# Altium project UTHP Truck Cape.PrjPcb (part 1 of 2)
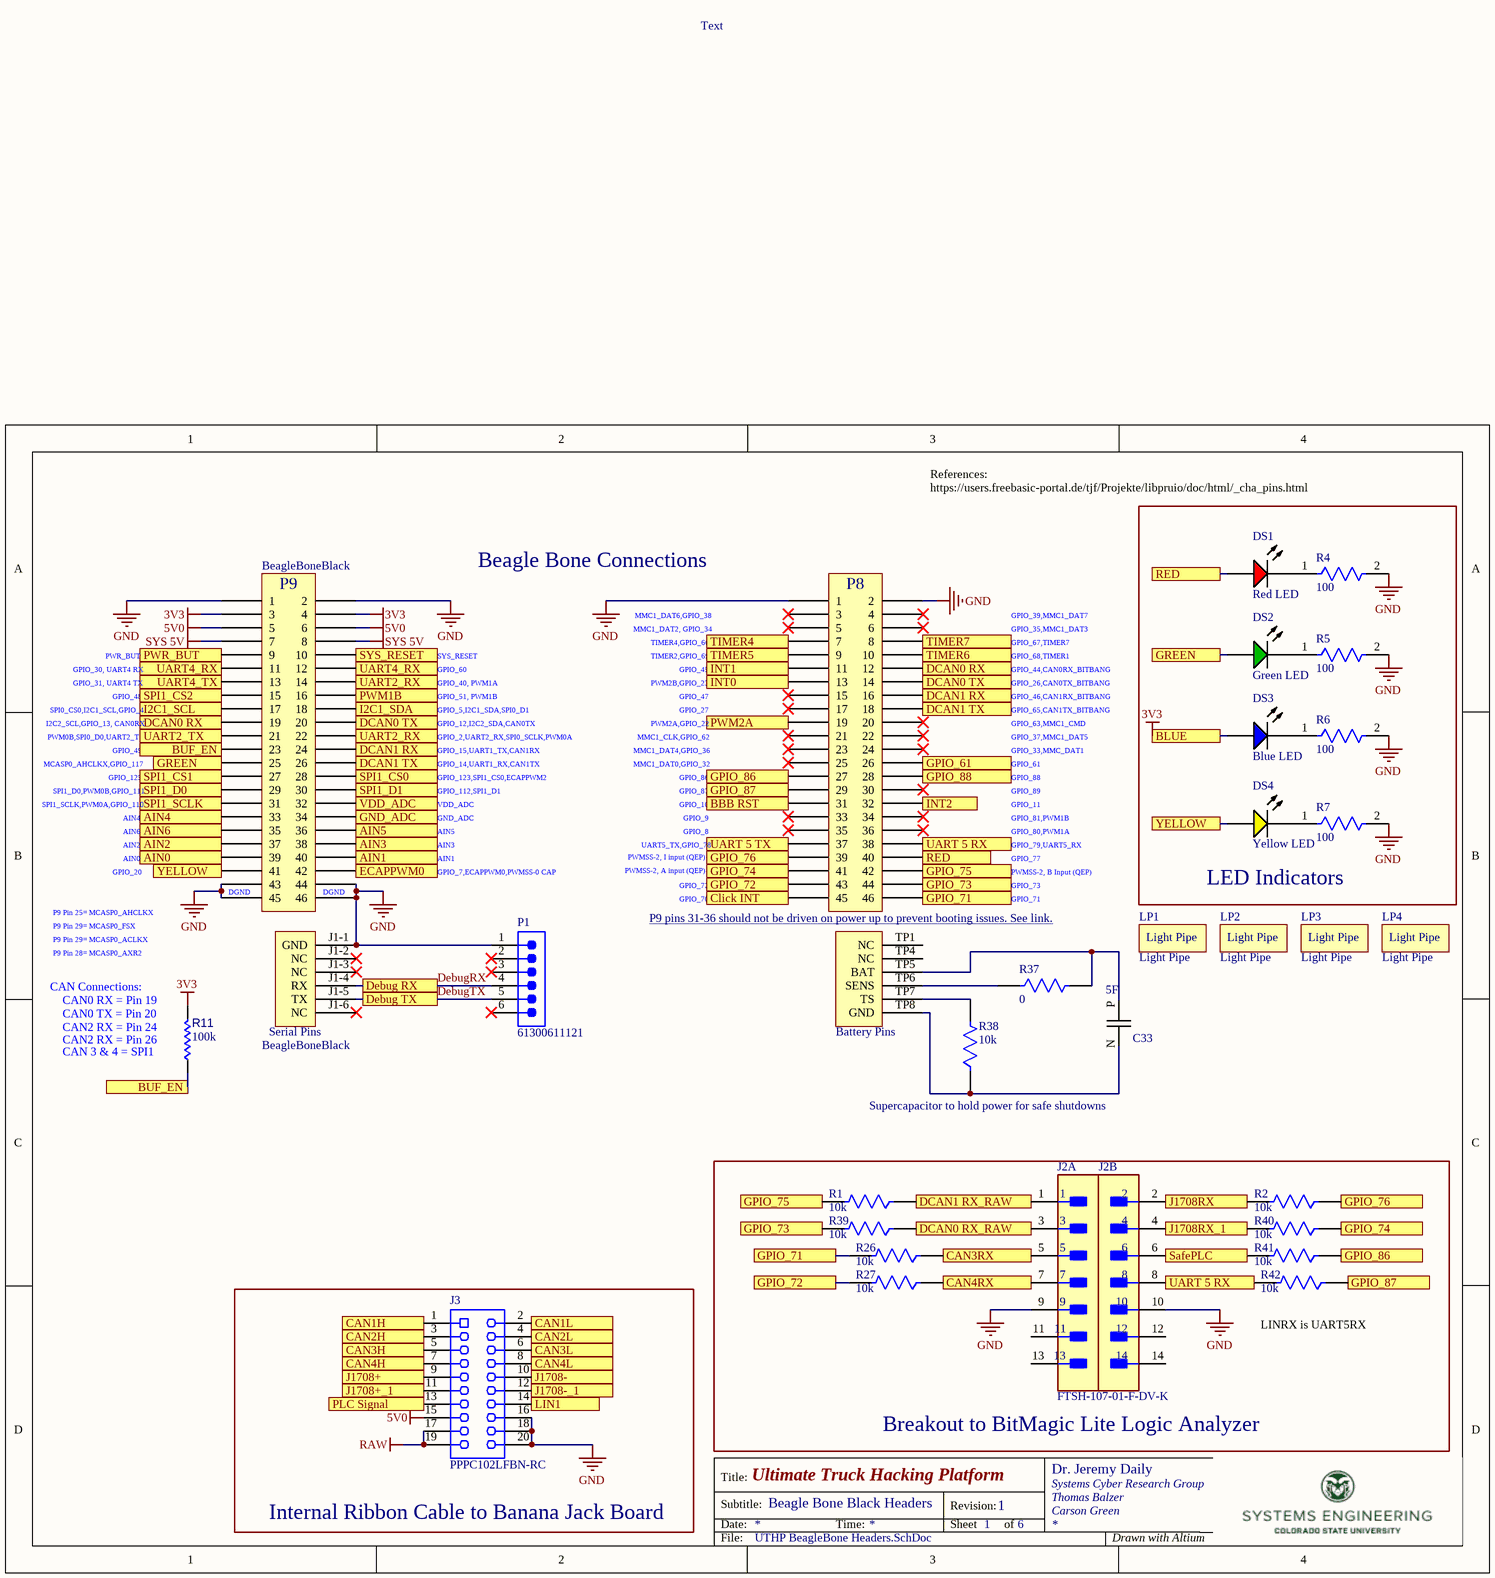
[diagram p0: UTHP BeagleBone Headers.SchDoc]
Sheet1Name: UTHP BeagleBone Headers; Sheet2Name: UTHP CAN Connections; SheetName3: UTHP Buffer Circuits; SheetSubtitle: BeagleBone Headers
6 sheets, 134 parts. Net scope: flat (ports and power ports of the same name join across sheets).
Board file: UTHP_PCB1.PcbDoc
Sheets:
  UTHP BeagleBone Headers.SchDoc
  UTHP CAN Connections.SchDoc
  UTHP Edge Connectors.SchDoc
  UTHP Power Supply and PLC.SchDoc
  UTHP Buffer Circuits.SchDoc
  UTHP J1708 LIN RTC.SchDoc

## Sheet UTHP BeagleBone Headers.SchDoc: Ultimate Truck Hacking Platform
size Letter; Author: Dr. Jeremy Daily; Organization: Systems Cyber Research Group; Address2: Thomas Balzer; Address3: Carson Green; DocumentNumber: Beagle Bone Black Headers; Revision: 1; SheetNumber: 1; SheetTotal: 6; ENG_APP_DATE: --/--/--; DSN_APP_DATE: --/--/--; CHK_APP_DATE: --/--/--

### Parts
BeagleBoneBlack  BeagleBoneBlack  [Beagleboneblack]
C33  5F  [New footprint 1]
DS1  Red LED  [LTST-C191KRKT_V]
DS2  Green LED  [LTST-C190GKT_V]
DS3  Blue LED  [LTST-C190TBKT-2_V]
DS4  Yellow LED  [LTST-C190KSKT_V]
J2  FTSH-107-01-F-DV-K  [FP-FTSH-107-01-F-DV-K-MFG]  (parts A,B of 2)
J3  PPPC102LFBN-RC  [SLIN-PPPC102LFBN-RC_V]
LP1  Light Pipe  [Lightpipe - SLP3]
LP2  Light Pipe  [Lightpipe - SLP3]
LP3  Light Pipe  [Lightpipe - SLP3]
LP4  Light Pipe  [Lightpipe - SLP3]
P1  61300611121  [61300611121]
R1  10k  [FP-KTR03-IPC_B]
R2  10k  [FP-KTR03-IPC_B]
R4  100  [FP-CRGCQ0603-IPC_C]
R5  100  [FP-CRGCQ0603-IPC_C]
R6  100  [FP-CRGCQ0603-IPC_C]
R7  100  [FP-CRGCQ0603-IPC_C]
R11  value 100k  [RESC1608X55X25ML10T15]  (hidden comment: Resistor 100k +/-1% 0603 100 mW)
R26  10k  [FP-KTR03-IPC_B]
R27  10k  [FP-KTR03-IPC_B]
R37  0  [FP-RMCF0805-MFG]
R38  10k  [FP-KTR03-IPC_B]
R39  10k  [FP-KTR03-IPC_B]
R40  10k  [FP-KTR03-IPC_B]
R41  10k  [FP-KTR03-IPC_B]
R42  10k  [FP-KTR03-IPC_B]

### Blocks framed on the sheet
LED Indicators: DS1-DS4 R4-R7
Breakout to BitMagic Lite Logic Analyzer: J2 R1 R2 R26 R27 R39-R42
Internal Ribbon Cable to Banana Jack Board: J3

### Ports
AIN0, AIN1, AIN2, AIN3, AIN4, AIN5, AIN6, BBB RST, BLUE, BUF_EN, CAN1H, CAN1L, CAN2H, CAN2L, CAN3H, CAN3L, CAN3RX, CAN4H, CAN4L, CAN4RX, Click INT, DCAN0 RX, DCAN0 RX_RAW, DCAN0 TX, DCAN1 RX, DCAN1 RX_RAW, DCAN1 TX, Debug RX, Debug TX, ECAPPWM0, GND_ADC, GPIO_61, GPIO_71, GPIO_72, GPIO_73, GPIO_74, GPIO_75, GPIO_76, GPIO_86, GPIO_87, GPIO_88, GREEN, I2C1_SCL, I2C1_SDA, INT0, INT1, INT2, J1708+, J1708+_1, J1708-, J1708-_1, J1708RX, J1708RX_1, LIN1, PLC Signal, PWM1B, PWM2A, PWR_BUT, RED, SafePLC, SPI1_CS0, SPI1_CS1, SPI1_CS2, SPI1_D0, SPI1_D1, SPI1_SCLK, SYS_RESET, TIMER4, TIMER5, TIMER6, TIMER7, UART2_RX, UART2_TX, UART4_RX, UART4_TX, UART 5 RX, UART 5 TX, VDD_ADC, YELLOW

### Nets
3V3: BeagleBoneBlack.3 BeagleBoneBlack.4 DS3.1(A) R11.2 ; port BLUE
5V0: BeagleBoneBlack.5 BeagleBoneBlack.6 J3.15
GND: BeagleBoneBlack.1 BeagleBoneBlack.2 BeagleBoneBlack.43 BeagleBoneBlack.44 BeagleBoneBlack.45 BeagleBoneBlack.46 BeagleBoneBlack.J1-1(GND) BeagleBoneBlack.P1(1) BeagleBoneBlack.P2(2) J2.9 J2.10 J3.16 J3.18 J3.20 P1.1 R4.2 R5.2 R6.2 R7.2
RAW: J3.17 J3.19
SYS 5V: BeagleBoneBlack.7 BeagleBoneBlack.8
AIN0: BeagleBoneBlack.39 ; port AIN0
AIN1: BeagleBoneBlack.40 ; port AIN1
AIN2: BeagleBoneBlack.37 ; port AIN2
AIN3: BeagleBoneBlack.38 ; port AIN3
AIN4: BeagleBoneBlack.33 ; port AIN4
AIN5: BeagleBoneBlack.36 ; port AIN5
AIN6: BeagleBoneBlack.35 ; port AIN6
BBB RST: BeagleBoneBlack.P31(31) ; port BBB RST
BUF_EN: BeagleBoneBlack.23 R11.1 ; port BUF_EN
CAN1H: J3.1 ; port CAN1H
CAN1L: J3.2 ; port CAN1L
CAN2H: J3.3 ; port CAN2H
CAN2L: J3.4 ; port CAN2L
CAN3H: J3.5 ; port CAN3H
CAN3L: J3.6 ; port CAN3L
CAN3RX: J2.5 R26.1 ; port CAN3RX
CAN4H: J3.7 ; port CAN4H
CAN4L: J3.8 ; port CAN4L
CAN4RX: J2.7 R27.1 ; port CAN4RX
Click INT: BeagleBoneBlack.P45(45) ; port Click INT
DCAN0 RX: BeagleBoneBlack.19 BeagleBoneBlack.P12(12) ; port DCAN0 RX
DCAN0 RX_RAW: J2.3 R39.1 ; port DCAN0 RX_RAW
DCAN0 TX: BeagleBoneBlack.20 BeagleBoneBlack.P14(14) ; port DCAN0 TX
DCAN1 RX: BeagleBoneBlack.24 BeagleBoneBlack.P16(16) ; port DCAN1 RX
DCAN1 RX_RAW: J2.1 R1.1 ; port DCAN1 RX_RAW
DCAN1 TX: BeagleBoneBlack.26 BeagleBoneBlack.P18(18) ; port DCAN1 TX
DebugRX: BeagleBoneBlack.J1-4(RX) P1.4 ; port Debug RX
DebugTX: BeagleBoneBlack.J1-5(TX) P1.5 ; port Debug TX
ECAPPWM0: BeagleBoneBlack.42 ; port ECAPPWM0
GND_ADC: BeagleBoneBlack.34 ; port GND_ADC
GPIO_61: BeagleBoneBlack.P26(26) ; port GPIO_61
GPIO_71: BeagleBoneBlack.P46(46) R26.2 ; port GPIO_71
GPIO_72: BeagleBoneBlack.P43(43) R27.2 ; port GPIO_72
GPIO_73: BeagleBoneBlack.P44(44) R39.2 ; port GPIO_73
GPIO_74: BeagleBoneBlack.P41(41) R40.1 ; port GPIO_74
GPIO_75: BeagleBoneBlack.P42(42) R1.2 ; port GPIO_75
GPIO_76: BeagleBoneBlack.P39(39) R2.1 ; port GPIO_76
GPIO_86: BeagleBoneBlack.P27(27) R41.1 ; port GPIO_86
GPIO_87: BeagleBoneBlack.P29(29) R42.1 ; port GPIO_87
GPIO_88: BeagleBoneBlack.P28(28) ; port GPIO_88
GREEN: BeagleBoneBlack.25 DS2.1(A) ; port GREEN
I2C1_SCL: BeagleBoneBlack.17 ; port I2C1_SCL
I2C1_SDA: BeagleBoneBlack.18 ; port I2C1_SDA
INT0: BeagleBoneBlack.P13(13) ; port INT0
INT1: BeagleBoneBlack.P11(11) ; port INT1
INT2: BeagleBoneBlack.P32(32) ; port INT2
J1708+: J3.9 ; port J1708+
J1708+_1: J3.11 ; port J1708+_1
J1708-: J3.10 ; port J1708-
J1708-_1: J3.12 ; port J1708-_1
J1708RX: J2.2 R2.2 ; port J1708RX
J1708RX_1: J2.4 R40.2 ; port J1708RX_1
LIN1: J3.14 ; port LIN1
PLC Signal: J3.13 ; port PLC Signal
PWM1B: BeagleBoneBlack.16 ; port PWM1B
PWM2A: BeagleBoneBlack.P19(19) ; port PWM2A
PWR_BUT: BeagleBoneBlack.9 ; port PWR_BUT
RED: BeagleBoneBlack.P40(40) DS1.1(A) ; port RED
SafePLC: J2.6 R41.2 ; port SafePLC
SPI1_CS0: BeagleBoneBlack.28 ; port SPI1_CS0
SPI1_CS1: BeagleBoneBlack.27 ; port SPI1_CS1
SPI1_CS2: BeagleBoneBlack.15 ; port SPI1_CS2
SPI1_D0: BeagleBoneBlack.29 ; port SPI1_D0
SPI1_D1: BeagleBoneBlack.30 ; port SPI1_D1
SPI1_SCLK: BeagleBoneBlack.31 ; port SPI1_SCLK
SYS_RESET: BeagleBoneBlack.10 ; port SYS_RESET
TIMER4: BeagleBoneBlack.P7(7) ; port TIMER4
TIMER5: BeagleBoneBlack.P9(9) ; port TIMER5
TIMER6: BeagleBoneBlack.P10(10) ; port TIMER6
TIMER7: BeagleBoneBlack.P8(8) ; port TIMER7
UART2_RX: BeagleBoneBlack.14 BeagleBoneBlack.22 ; port UART2_RX
UART2_TX: BeagleBoneBlack.21 ; port UART2_TX
UART4_RX: BeagleBoneBlack.11 BeagleBoneBlack.12 ; port UART4_RX
UART4_TX: BeagleBoneBlack.13 ; port UART4_TX
UART 5 RX: BeagleBoneBlack.P38(38) J2.8 R42.2 ; port UART 5 RX
UART 5 TX: BeagleBoneBlack.P37(37) ; port UART 5 TX
VDD_ADC: BeagleBoneBlack.32 ; port VDD_ADC
YELLOW: BeagleBoneBlack.41 DS4.1(A) ; port YELLOW
NetBeagleBoneBlack_TP5: BeagleBoneBlack.TP5(BAT) C33.P R37.2
NetBeagleBoneBlack_TP6: BeagleBoneBlack.TP6(SENS) R37.1
NetBeagleBoneBlack_TP7: BeagleBoneBlack.TP7(TS) R38.2
NetBeagleBoneBlack_TP8: BeagleBoneBlack.TP8(GND) C33.N R38.1
NetDS1_2: DS1.2(K) R4.1
NetDS2_2: DS2.2(K) R5.1
NetDS3_2: DS3.2(K) R6.1
NetDS4_2: DS4.2(K) R7.1

Not connected (* = marked no-connect by the designer): BeagleBoneBlack J1-2(NC)* J1-3(NC)* J1-6(NC)* P3(3)* P4(4)* P5(5)* P6(6)* P15(15)* P17(17)* P20(20)* P21(21)* P22(22)* P23(23)* P24(24)* P25(25)* P30(30)* P33(33)* P34(34)* P35(35)* P36(36)* TP1(NC) TP4(NC); J2 11 12 13 14; P1 2* 3* 6*

### Notes on the sheet
- Text
- References:
  https://users.freebasic-portal.de/tjf/Projekte/libpruio/doc/html/_cha_pins.html
- (near BeagleBoneBlack) Beagle Bone Connections
- PWR_BUT
- (near BeagleBoneBlack) SYS_RESET
- (near BeagleBoneBlack) MMC1_DAT2, GPIO_34
- (near BeagleBoneBlack) MMC1_DAT6,GPIO_38
- (near BeagleBoneBlack) TIMER4,GPIO_66
- (near BeagleBoneBlack) TIMER2,GPIO_69
- GPIO_39,MMC1_DAT7
- GPIO_35,MMC1_DAT3
- GPIO_67,TIMER7
- GPIO_68,TIMER1
- SPI0_CS0,I2C1_SCL,GPIO_4
- GPIO_30, UART4 RX
- GPIO_31, UART4 TX
- GPIO_48
- (near BeagleBoneBlack) GPIO_60
- (near BeagleBoneBlack) GPIO_40, PWM1A
- (near BeagleBoneBlack) GPIO_51, PWM1B
- (near BeagleBoneBlack) GPIO_5,I2C1_SDA,SPI0_D1
- (near BeagleBoneBlack) PWM2B,GPIO_23
- (near BeagleBoneBlack) GPIO_45
- (near BeagleBoneBlack) GPIO_47
- (near BeagleBoneBlack) GPIO_27
- GPIO_44,CAN0RX_BITBANG
- GPIO_26,CAN0TX_BITBANG
- GPIO_46,CAN1RX_BITBANG
- GPIO_65,CAN1TX_BITBANG
- MCASP0_AHCLKX,GPIO_117
- I2C2_SCL,GPIO_13, CAN0RX
- PWM0B,SPI0_D0,UART2_TX
- SPI1_D0,PWM0B,GPIO_111
- GPIO_125
- GPIO_49
- (near BeagleBoneBlack) GPIO_12,I2C2_SDA,CAN0TX
- (near BeagleBoneBlack) GPIO_2,UART2_RX,SPI0_SCLK,PWM0A
- (near BeagleBoneBlack) GPIO_15,UART1_TX,CAN1RX
- (near BeagleBoneBlack) GPIO_14,UART1_RX,CAN1TX
- (near BeagleBoneBlack) GPIO_123,SPI1_CS0,ECAPPWM2
- (near BeagleBoneBlack) GPIO_112,SPI1_D1
- (near BeagleBoneBlack) MMC1_DAT4,GPIO_36
- (near BeagleBoneBlack) MMC1_DAT0,GPIO_32
- (near BeagleBoneBlack) MMC1_CLK,GPIO_62
- (near BeagleBoneBlack) PWM2A,GPIO_22
- (near BeagleBoneBlack) GPIO_86
- (near BeagleBoneBlack) GPIO_87
- GPIO_63,MMC1_CMD
- GPIO_37,MMC1_DAT5
- GPIO_33,MMC_DAT1
- GPIO_61
- GPIO_88
- GPIO_89
- SPI1_SCLK,PWM0A,GPIO_110
- AIN4
- AIN6
- AIN2
- (near BeagleBoneBlack) VDD_ADC
- (near BeagleBoneBlack) GND_ADC
- (near BeagleBoneBlack) AIN5
- (near BeagleBoneBlack) AIN3
- (near BeagleBoneBlack) UART5_TX,GPIO_78
- (near BeagleBoneBlack) GPIO_10
- (near BeagleBoneBlack) GPIO_9
- (near BeagleBoneBlack) GPIO_8
- (near BeagleBoneBlack) PWMSS-2, I input (QEP)
- GPIO_11
- GPIO_81,PWM1B
- GPIO_80,PWM1A
- GPIO_79,UART5_RX
- P9 Pin 25= MCASP0_AHCLKX
- P9 Pin 29= MCASP0_FSX
- GPIO_20
- AIN0
- (near BeagleBoneBlack) DGND
- (near BeagleBoneBlack) AIN1
- (near BeagleBoneBlack) GPIO_7,ECAPPWM0,PWMSS-0 CAP
- (near BeagleBoneBlack) P9 pins 31-36 should not be driven on power up to prevent booting issues. See link. <https://docs.beagleboard.org/latest/boards/beaglebone/black/ch08.html#boot-pin>
- (near BeagleBoneBlack) GPIO_72
- (near BeagleBoneBlack) GPIO_70
- (near BeagleBoneBlack) PWMSS-2, A input (QEP)
- GPIO_77
- PWMSS-2, B Input (QEP)
- GPIO_73
- GPIO_71
- (near R11) CAN Connections:
- P9 Pin 29= MCASP0_ACLKX
- P9 Pin 28= MCASP0_AXR2
- (near R11) CAN0 TX = Pin 20
- (near R11) CAN0 RX = Pin 19
- (near R11) CAN2 RX = Pin 24
- (near R11) CAN2 RX = Pin 26
- (near R11) CAN 3 & 4 = SPI1
- (near R38) Supercapacitor to hold power for safe shutdowns
- Type @ to refer to a designator or a net
- (near R42) LINRX is UART5RX
- Title:
- Subtitle:
- Date:
- Time:
- Revision:
- Sheet
- of
- File:
- Drawn with Altium
- (in symbol CMP-061-000000-1) Serial Pins; Battery Pins

### Library data of the parts
BeagleBoneBlack = CMP-061-000000-1: Revision C with all headers and test points; Manufacturer: BeagleBoard by Seeed Studio; Part Number: 102110420; Value: BeagleBone Black Revision C; Supplier 1: Digi-Key; Supplier Part Number 1: 2820-102110420-ND
C33 = CMP-001-00088-1: DSF505Q6R0JBG; Manufacturer: Panasonic Electronic Components; Part Number: ERJ-3EKF4701V; Value: 4.7k; Supplier 1: Digi-Key; Supplier Part Number 1: P4.70KHCT-ND
DS1 = CMP-007-00024-2: LED Uni-Color Red, 62.5 mW, 25 mA, -30 to 85 degC, 2-Pin SMD, RoHS, Tape and Reel; Manufacturer: Lite-On
DS2 = CMP-007-00022-2: LED Uni-Color Green, 100 mW, 30 mA, -55 to 85 degC, 2-Pin SMD, RoHS, Tape and Reel; Manufacturer: Lite-On
DS3 = CMP-007-00026-2: LED Uni-Color Blue, 76 mW, 20 mA, -20 to 80 degC, 2-Pin SMD, RoHS, Tape and Reel; Manufacturer: Lite-On
DS4 = CMP-007-00025-2: LED Uni-Color Yellow, 75 mW, 30 mA, -30 to 85 degC, 2-Pin SMD, RoHS, Tape and Reel; Manufacturer: Lite-On
J2 = CMP-02766-001448-1: CONN HEADER SMD 14POS 1.27MM; Gender: Male; Connector Type: Male Pin; Number of Contacts: 14; Row Spacing: 0.05inch; Min Operating Temperature: -55°C; Package Quantity: 1; Lead Free: Lead Free; RoHS Compliant: Yes; Contact Material: Bronze; Contact Plating: Gold; Number of Rows: 2; Housing Material: Polymer; Contact Type: Male Pin; Series: FTSH; Max Operating Temperature: 125°C; Orientation: Straight; Number of Positions: 14; Pitch: 1.27mm; Housing Color: Black; Color: Black; Radiation Hardening: No; Length: 8.89mm; Termination: Solder; Packaging: Rail/Tube; Depth: 5.84mm; Mount: Surface Mount; Contact Mating Length: 0.12inch
J3 = CMP-002-00029-2: Female Header, Pitch 2.54 mm, 2 x 10 Position, Height 8.75 mm, Tail Length 3.2 mm, -40 to 105 degC, RoHS, Bulk; Manufacturer: Sullins
LP1-LP4 = CMP-023-000058-1: Design Item ID: Light Pipe; Source: SSS Schematic Library.SchLib; Pin Count: 0; Component Type: Standard
  LP1: Parameter 1: *
P1 = CMP-1502-01070-2: Termination: Through Hole
R1 R2 R26 R27 R38-R42 = CMP-08839-030382-1: 10 kOhms ±1% 0.1W, 1/10W Chip Resistor 0603 (1608 Metric) Automotive AEC-Q200, High Voltage Thick Film; Manufacturer: Rohm Semiconductor; Part Number: KTR03EZPF1002; Supplier 1: Digi-Key; Supplier Part Number 1: RHM10.0KAYCT-ND; Value: 10k
R4-R7 = CMP-03211-002191-1: CRGCQ0603 100Ω 1% ±200ppm/°C 75V; Manufacturer Part Number: CRGCQ0603F100R; Manufacturer: TE Connectivity; Value: 100Ω
R11 = CMP-009-00023-7: Chip Resistor, 100 KOhm, +/- 1%, 0.1 W, -55 to 155 degC, 0603 (1608 Metric); Voltage Rating: 50V; Power: 100mW; Max Operating Temperature: 155°C; Pins: 2; Mounting Technology: SM; Min Operating Temperature: -55°C; Case/Package: 0603; Tolerance: 1%; RoHS Compliant: True
R37 = CMP-26527-000017-1: RES 0 OHM JUMPER 1/8W 0805; Manufacturer: Stackpole Electronics Inc; Part Number: RMCF0805ZT0R00; Supplier 1: Digi-Key; Supplier Part Number 1: RMCF0805ZT0R00CT-ND; Value: 0

## Sheet UTHP CAN Connections.SchDoc: Ultimate Truck Hacking Platform
size Letter; Author: Dr. Jeremy Daily; Organization: Systems Cyber Research Group; Address2: Thomas Balzer; Address3: Carson Green; DocumentNumber: Controller Area Networks; Revision: 1; SheetNumber: 2; SheetTotal: 6
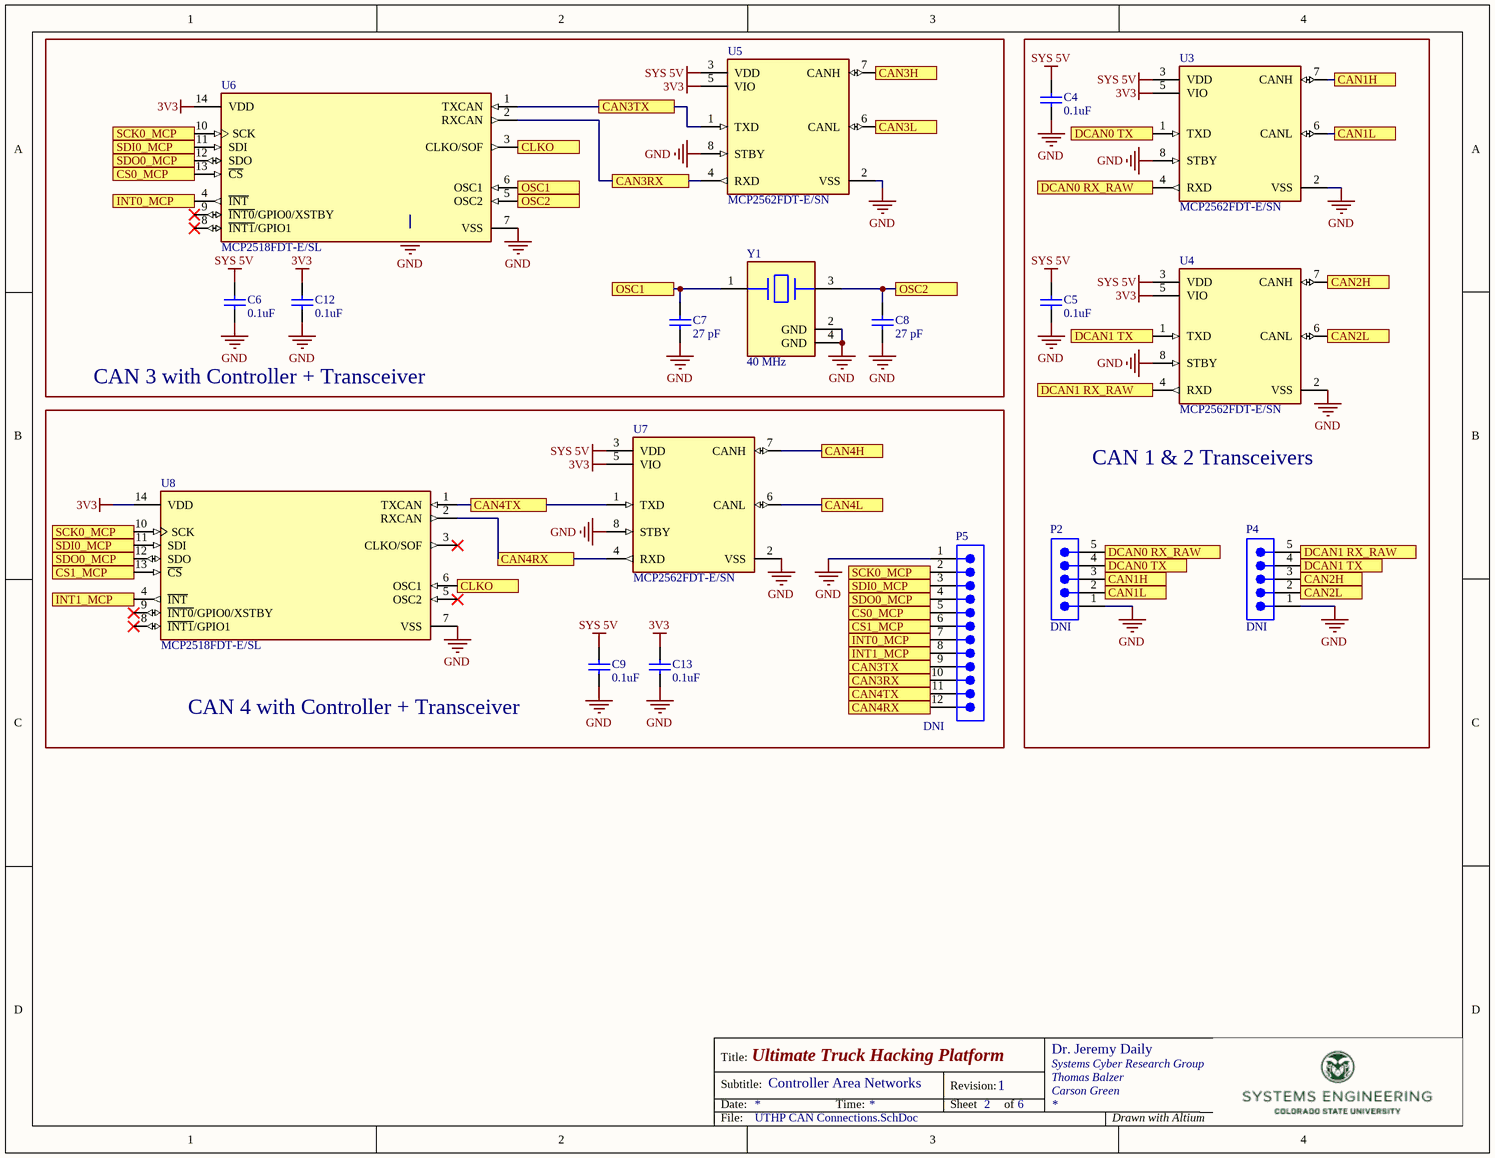
[diagram p1: UTHP CAN Connections.SchDoc]

### Parts
C4  0.1uF  [CAPC1608X90X35LL15T15]
C5  0.1uF  [CAPC1608X90X35LL15T15]
C6  0.1uF  [CAPC1608X90X35LL15T15]
C7  27 pF  [CAPC1005X55X25LL05T10]
C8  27 pF  [CAPC1005X55X25LL05T10]
C9  0.1uF  [CAPC1608X90X35LL15T15]
C12  0.1uF  [CAPC1608X90X35LL15T15]
C13  0.1uF  [CAPC1608X90X35LL15T15]
P2  DNI  [61300511121]
P4  DNI  [61300511121]
P5  DNI  [61301211121]
U3  MCP2562FDT-E/SN  [FP-C04-057-SN-MFG]
U4  MCP2562FDT-E/SN  [FP-C04-057-SN-MFG]
U5  MCP2562FDT-E/SN  [FP-C04-057-SN-MFG]
U6  MCP2518FDT-E/SL  [FP-C04-065-SL-IPC_C]
U7  MCP2562FDT-E/SN  [FP-C04-057-SN-MFG]
U8  MCP2518FDT-E/SL  [FP-C04-065-SL-IPC_C]
Y1  40 MHz  [FP-ABM8G-MFG]

### Blocks framed on the sheet
CAN 3 with Controller + Transceiver: C6-C8 C12 U5 U6 Y1
CAN 1 & 2 Transceivers: C4 C5 P2 P4 U3 U4
CAN 4 with Controller + Transceiver: C9 C13 P5 U7 U8

### Ports
CAN1H, CAN1L, CAN2H, CAN2L, CAN3H, CAN3L, CAN3RX, CAN3TX, CAN4H, CAN4L, CAN4RX, CAN4TX, CLKO, CS0_MCP, CS1_MCP, DCAN0 RX_RAW, DCAN0 TX, DCAN1 RX_RAW, DCAN1 TX, INT0_MCP, INT1_MCP, OSC1, OSC2, SCK0_MCP, SDI0_MCP, SDO0_MCP

### Nets
3V3: C12.1 C13.1 U3.5(VIO) U4.5(VIO) U5.5(VIO) U6.14(VDD) U7.5(VIO) U8.14(VDD)
GND: C4.2 C5.2 C6.2 C7.1 C8.1 C9.2 C12.2 C13.2 P2.1 P4.1 P5.1 U3.2(VSS) U3.8(STBY) U4.2(VSS) U4.8(STBY) U5.2(VSS) U5.8(STBY) U6.7(VSS) U7.2(VSS) U7.8(STBY) U8.7(VSS) Y1.2(GND) Y1.4(GND)
SYS 5V: C4.1 C5.1 C6.1 C9.1 U3.3(VDD) U4.3(VDD) U5.3(VDD) U7.3(VDD)
CAN1H: P2.3 U3.7(CANH) ; port CAN1H
CAN1L: P2.2 U3.6(CANL) ; port CAN1L
CAN2H: P4.3 U4.7(CANH) ; port CAN2H
CAN2L: P4.2 U4.6(CANL) ; port CAN2L
CAN3H: U5.7(CANH) ; port CAN3H
CAN3L: U5.6(CANL) ; port CAN3L
CAN3RX: P5.10 U5.4(RXD) U6.2(RXCAN) ; port CAN3RX
CAN3TX: P5.9 U5.1(TXD) U6.1(TXCAN) ; port CAN3TX
CAN4H: U7.7(CANH) ; port CAN4H
CAN4L: U7.6(CANL) ; port CAN4L
CAN4RX: P5.12 U7.4(RXD) U8.2(RXCAN) ; port CAN4RX
CAN4TX: P5.11 U7.1(TXD) U8.1(TXCAN) ; port CAN4TX
CLKO: U6.3(CLKO/SOF) U8.6(OSC1) ; port CLKO
CS0_MCP: P5.5 U6.13(~{CS}) ; port CS0_MCP
CS1_MCP: P5.6 U8.13(~{CS}) ; port CS1_MCP
DCAN0 RX_RAW: P2.5 U3.4(RXD) ; port DCAN0 RX_RAW
DCAN0 TX: P2.4 U3.1(TXD) ; port DCAN0 TX
DCAN1 RX_RAW: P4.5 U4.4(RXD) ; port DCAN1 RX_RAW
DCAN1 TX: P4.4 U4.1(TXD) ; port DCAN1 TX
INT0_MCP: P5.7 U6.4(~{INT}) ; port INT0_MCP
INT1_MCP: P5.8 U8.4(~{INT}) ; port INT1_MCP
OSC1: C7.2 U6.6(OSC1) Y1.1 ; port OSC1
OSC2: C8.2 U6.5(OSC2) Y1.3 ; port OSC2
SCK0_MCP: P5.2 U6.10(SCK) U8.10(SCK) ; port SCK0_MCP
SDI0_MCP: P5.3 U6.11(SDI) U8.11(SDI) ; port SDI0_MCP
SDO0_MCP: P5.4 U6.12(SDO) U8.12(SDO) ; port SDO0_MCP

Not connected (* = marked no-connect by the designer): U6 8(~{INT1}/GPIO1)* 9(~{INT0}/GPIO0/XSTBY)*; U8 3(CLKO/SOF)* 5(OSC2)* 8(~{INT1}/GPIO1)* 9(~{INT0}/GPIO0/XSTBY)*

### Notes on the sheet
- Title:
- Subtitle:
- Date:
- Time:
- Revision:
- Sheet
- of
- File:
- Drawn with Altium

### Library data of the parts
C4-C6 C9 C12 C13 = CMP-2006-04387-1: 0.1 µF ±10% 50V Ceramic Capacitor X7R 0603 (1608 Metric); Manufacturer: KYOCERA AVX; Part Number: KAM15AR71H104KM; Supplier 1: Digi-Key; Supplier Part Number 1: 478-KAM15AR71H104KMTR-ND; Value: 0.1uF
C7 C8 = CMP-2008-03917-1: 27 pF ±5% 50V Ceramic Capacitor C0G, NP0 0402 (1005 Metric); Part Number: GRM1555C1H270JA01D; Manufacturer: Murata; Value: 27pF; Supplier 1: Digi-Key; Supplier Part Number 1: 490-5869-1-ND
P2 P4 = CMP-1502-01068-2: NexarPartId: 32855526; Operating Supply Voltage: 250V; Number of Contacts: 5; Connector Type: Male Pin; Current Rating: 3A; Contact Resistance: 20mΩ; Pitch: 2.54mm; Gender: Male; Termination: Solder; RoHS: Compliant; Lead Pitch: 2.54mm; Contact Mating Length: 5.9944mm; Number of Positions: 5; Lead Free: Lead Free; Contact Plating: Gold; Number of Pins: 5; Min Operating Temperature: -40°C; Voltage Rating: 250V; Color: Black; Mount: Through Hole; REACH SVHC: Unknown; Packaging: Bulk; Height: 8.89mm; Number of Rows: 1; Orientation: Vertical; Contact Material: Copper; Max Operating Temperature: 105°C
P5 = CMP-1502-01086-2: NexarPartId: 32855538; Gender: Male; Pitch: 2.54mm; Contact Resistance: 20mΩ; Number of Positions: 12; Current Rating: 3A; Connector Type: Male Pin; Operating Supply Voltage: 250V; Contact Material: Copper; Contact Plating: Gold; Color: Black; REACH SVHC: Unknown; Termination: Solder; Number of Contacts: 12; RoHS: Compliant; Lead Pitch: 2.54mm; Orientation: Vertical; Contact Mating Length: 5.9944mm; Mount: Through Hole; Number of Pins: 12; Packaging: Bulk; Number of Rows: 1
U3-U5 U7 = CMP-06279-000005-1: 1/1 Transceiver CANbus 8-SOIC; Manufacturer: Microchip; Value: CAN Transceiver; Part Number: MCP2562FDT-E/SN; Supplier 1: Digi-Key; Supplier Part Number 1: MCP2562FDT-E/SNCT-ND
U6 U8 = CMP-06298-000019-1: IC CAN CONTROLLER SPI 14SOIC; RoHS Compliant: Yes
Y1 = CMP-27762-015223-1: 40 MHz ±20ppm Crystal 18pF 50 Ohms 4-SMD, No Lead; Manufacturer: Abracon LLC; Part Number: ABM8G-40.000MHZ-18-D2Y-T; Value: 40MHz; Supplier 1: Digi-Key; Supplier Part Number 1: 535-10281-1-ND

## Sheet UTHP Edge Connectors.SchDoc: Ultimate Truck Hacking Platform
size Letter; Author: Dr. Jeremy Daily; Organization: Systems Cyber Research Group; Address2: Thomas Balzer; Address3: Carson Green; DocumentNumber: Board Interfaces; Revision: 1; SheetNumber: 3; SheetTotal: 6
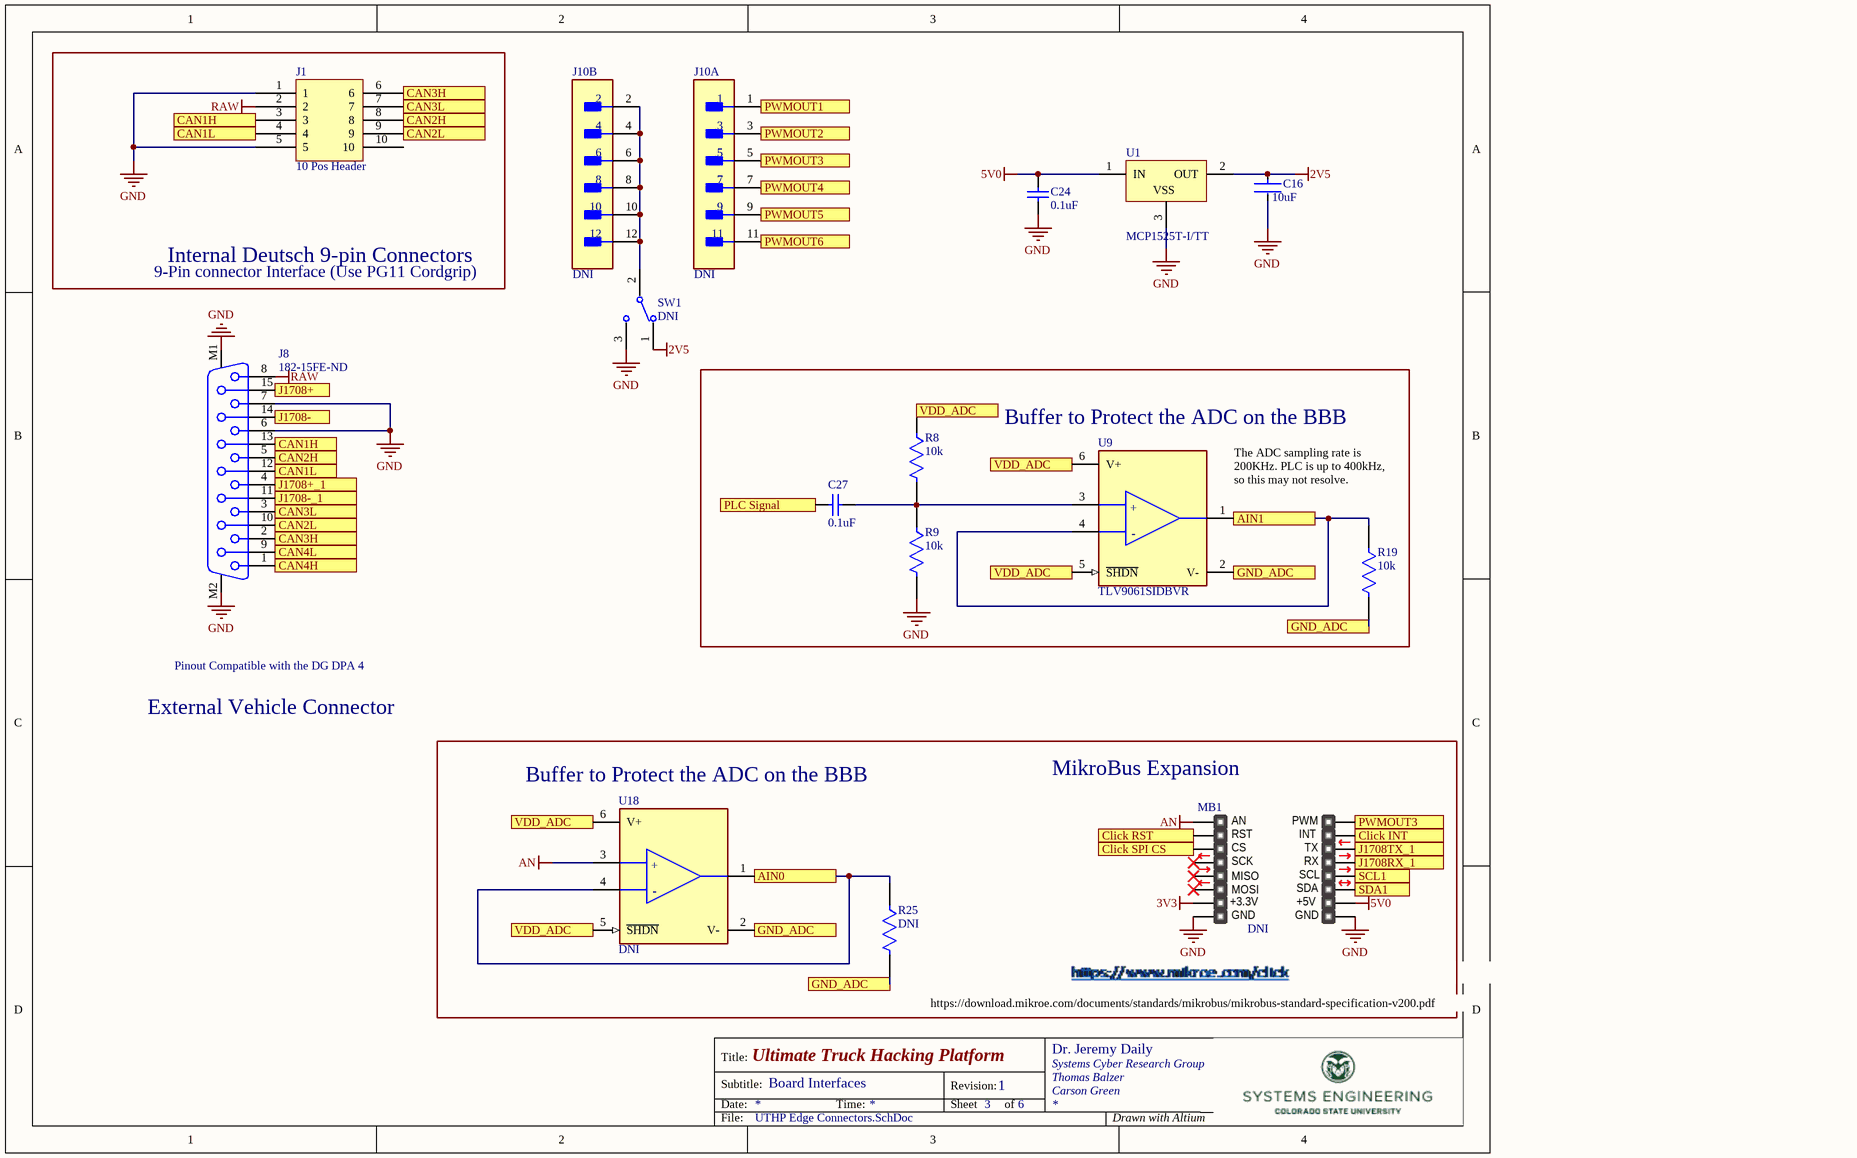
[diagram p2: UTHP Edge Connectors.SchDoc]

### Parts
C16  10uF  [FP-MK325A-MFG]
C24  0.1uF  [CAPC1608X90X35LL15T15]
C27  0.1uF  [CAPC1608X90X35LL15T15]
J1  10 Pos Header  [10 pos Mini-Fit Jr. R/A Header]
J8  182-15FE-ND  [618015231321]
J10  DNI  [FP-70246-1201-0]  (parts A,B of 2)
MB1  DNI  [mikroBUS - Large]  (no BOM)
R8  10k  [FP-KTR03-IPC_B]
R9  10k  [FP-KTR03-IPC_B]
R19  10k  [FP-KTR03-IPC_B]
R25  DNI  [FP-KTR03-IPC_B]
SW1  DNI  [FP-CS12ANW03-MFG]
U1  MCP1525T-I/TT  [SOT-23-TT3_M]
U9  TLV9061SIDBVR  [FP-DBV0006A-MFG]
U18  DNI  [FP-DBV0006A-MFG]

### Blocks framed on the sheet
Internal Deutsch 9-pin Connectors: J1
Buffer to Protect the ADC on the BBB: C27 R8 R9 R19 U9

### Ports
AIN0, AIN1, CAN1H, CAN1L, CAN2H, CAN2L, CAN3H, CAN3L, CAN4H, CAN4L, Click INT, Click RST, Click SPI CS, GND_ADC, J1708+, J1708+_1, J1708-, J1708-_1, J1708RX_1, J1708TX_1, PLC Signal, PWMOUT1, PWMOUT2, PWMOUT3, PWMOUT4, PWMOUT5, PWMOUT6, SCL1, SDA1, VDD_ADC

### Nets
2V5: C16.1 SW1.1 U1.2(OUT)
3V3: MB1.7(3.3V)
5V0: C24.1 MB1.10(5V) U1.1(IN)
AN: MB1.1(AN) U18.3(+IN)
GND: C16.2 C24.2 J1.1 J1.5 J8.6 J8.7 J8.M1 J8.M2 MB1.8(GND) MB1.9(GND) R9.2 SW1.3 U1.3(VSS)
RAW: J1.2 J8.8
AIN0: R25.1 U18.1(OUT) U18.4(-IN) ; port AIN0
AIN1: R19.1 U9.1(OUT) U9.4(-IN) ; port AIN1
CAN1H: J1.3 J8.13 ; port CAN1H
CAN1L: J1.4 J8.12 ; port CAN1L
CAN2H: J1.8 J8.5 ; port CAN2H
CAN2L: J1.9 J8.10 ; port CAN2L
CAN3H: J1.6 J8.2 ; port CAN3H
CAN3L: J1.7 J8.3 ; port CAN3L
CAN4H: J8.1 ; port CAN4H
CAN4L: J8.9 ; port CAN4L
Click INT: MB1.15(INT) ; port Click INT
Click RST: MB1.2(RST) ; port Click RST
Click SPI CS: MB1.3(CS) ; port Click SPI CS
GND_ADC: R19.2 R25.2 U9.2(V-) U18.2(V-) ; port GND_ADC
J1708+: J8.15 ; port J1708+
J1708+_1: J8.4 ; port J1708+_1
J1708-: J8.14 ; port J1708-
J1708-_1: J8.11 ; port J1708-_1
J1708RX_1: MB1.13(TX) ; port J1708RX_1
J1708TX_1: MB1.14(RX) ; port J1708TX_1
PLC Signal: C27.1 ; port PLC Signal
PWMOUT1: J10.1 ; port PWMOUT1
PWMOUT2: J10.3 ; port PWMOUT2
PWMOUT3: J10.5 MB1.16(PWM) ; port PWMOUT3
PWMOUT4: J10.7 ; port PWMOUT4
PWMOUT5: J10.9 ; port PWMOUT5
PWMOUT6: J10.11 ; port PWMOUT6
SCL1: MB1.12(SCL) ; port SCL1
SDA1: MB1.11(SDA) ; port SDA1
VDD_ADC: R8.1 U9.5(~{SHDN}) U9.6(V+) U18.5(~{SHDN}) U18.6(V+) ; port VDD_ADC
NetC27_2: C27.2 R8.2 R9.1 U9.3(+IN)
NetJ10_2: J10.2 J10.4 J10.6 J10.8 J10.10 J10.12 SW1.2(2(COM))

Not connected (* = marked no-connect by the designer): J1 10; MB1 4(SCK)* 5(MISO)* 6(MOSI)*

### Notes on the sheet
- 9-Pin connector Interface (Use PG11 Cordgrip)
- (near U9) The ADC sampling rate is 200KHz. PLC is up to 400kHz, so this may not resolve.
- Pinout Compatible with the DG DPA 4
- External Vehicle Connector
- (near MB1) MikroBus Expansion
- (near U18) Buffer to Protect the ADC on the BBB
- https://download.mikroe.com/documents/standards/mikrobus/mikrobus-standard-specification-v200.pdf
- Title:
- Subtitle:
- Date:
- Time:
- Revision:
- Sheet
- of
- File:
- Drawn with Altium
- (in symbol CMP-068-000000-1) +3.3V; +5V
- (in symbol CMP-04895-000376-1) +; -

### Library data of the parts
C16 = CMP-14477-002214-1: CAP CER 10UF 50V X7R 1210 UMK325AB7106KM-T; Manufacturer: Taiyo Yuden; Part Number: UMK325AB7106KM-T; Supplier 1: Digi-Key; Supplier Part Number 1: 587-3167-1-ND
C24 C27 = CMP-2006-04387-1: as C4 on sheet UTHP CAN Connections; Supplier 1: Digi-Key; Supplier Part Number 1: 478-KAM15AR71H104KMTR-ND; Value: 0.1uF
J1 = CMP-025-000000-1: Connector Header Through Hole, Right Angle 10 position 0.165" (4.20mm); Manufacturer: Molex; Value: Molex 10-pos; Part Number: 39-30-1100; Supplier 1: Digi-Key; Supplier Part Number 1: WM1355-ND
J8 = CMP-1502-00205-2: NorComp Inc. Part #: 182-015-213R531 / Digikey Part #: 182-15FE-ND / Link: https://www.digikey.com/en/products/detail/norcomp-inc/182-015-213R531/858357; NexarPartId: 22865747; Insulation Resistance: 5GΩ; Number of Contacts: 15; Pitch: 2.77mm; Current Rating: 3A; Contact Resistance: 30mΩ; Gender: Female; Operating Supply Voltage: 125V; Number of Rows: 2; Number of Pins: 15; Termination: SMD/SMT; Depth: 20.75mm; Orientation: Right Angle; Contact Plating: Gold; Width: 12.5mm; RoHS: Compliant; REACH SVHC: Unknown; Max Operating Temperature: 105°C; Housing Material: Steel; Min Operating Temperature: -55°C; Voltage Rating: 125V; Insulation Material: PBT; Mount: Through Hole; Length: 24.76mm
J10 = CMP-00257-00249961-1: 70246-1201 Conn Shrouded Header (4 Sides) HDR 12 POS 2.54mm Solder ST Top Entry Thru-Hole C-Grid® Tray; NexarPartId: 249961; Connector Type: Male Pin; Max Voltage Rating (DC): 250V; Gender: Male; Number of Contacts: 12; Current Rating: 2.5A; Glow Wire Compliant: Non-compliant; Max Operating Temperature: 120°C; ELV: Compliant; Contact Plating: Gold; Orientation: Vertical; Height: 9.47mm; Pitch: 2.54mm; Lead Free: Lead Free; Length: 22.86mm; Contact Mating Length: 6.096mm; Voltage Rating: 250V; RoHS: Compliant; REACH SVHC: No SVHC; Color: Black; Min Operating Temperature: -55°C; Termination: Solder; Housing Color: Black; Depth: 8.89mm; Flammability Rating: UL94 V-0; Number of Rows: 2; Row Spacing: 2.54mm; Housing Material: Polyester; Number of Positions: 12; Contact Material: Bronze, Gold, Nickel; Mount: Through Hole; Number of Circuits: 12
MB1 = CMP-068-000000-1: mikroBUS compatible add-on board
R8 R9 R19 = CMP-08839-030382-1: as R1 on sheet UTHP BeagleBone Headers; Supplier 1: Digi-Key; Supplier Part Number 1: RHM10.0KAYCT-ND; Value: 10k
R25 = CMP-08839-030382-1: 10 kOhms ±1% 0.1W, 1/10W Chip Resistor 0603 (1608 Metric) Automotive AEC-Q200, High Voltage Thick Film; Manufacturer: Rohm Semiconductor; Part Number: KTR03EZPF1002; Value: 10k; Supplier 1: Digi-Key; Supplier Part Number 1: RHM10.0KAYCT-ND
SW1 = CMP-31746-000002-1: SWITCH SLIDE SPDT 3A 125V; Max Voltage Rating (AC): 250V; Mechanical Life: 50000Cycles; Switch Travel: 2.2mm; Electrical Life: 20000Cycles; Actuator Length: 5.1mm; Illumination Type: Non-Illuminated; Contact Style: Non-Shorting; Actuator Type: Standard; Actuator Material: Nylon; Switch Function: On-On; Max Operating Temperature: 85°C; Series: CS; Contact Current Rating: 3A; Min Operating Temperature: -30°C; Current Rating: 3A; Mount: Through Hole; Depth: 7.5mm; RoHS Compliant: Yes; Throw Configuration: SPDT; Lead Free: Lead Free; Orientation: Vertical; Contact Plating: Silver; Reach SVHC Compliant: Yes; Termination: PC Pin; Max Current Rating: 3A; Packaging: Tray; Length: 14mm; Package Quantity: 1; Primary Type: SWITCH; Flammability Rating: UL94 V-0; Contact Material: Copper; Voltage Rating (AC): 125V
U1 = CMP-0131-00003-1: 2.5V Voltage Reference, 3-Pin SOT-23, Industrial Temperature, Tape and Reel; DatasheetVersion: revB, Feb-2005; Code_IPC: SOT23-3; PackageDescription: 3-Lead Plastic Small Outline Transistor (TT) [SOT-23]; PackageReference: SOT-23-TT3; PackageVersion: revBB, Aug-2009
U9 U18 = CMP-04895-000376-1: IC CMOS 1 CIRCUIT SOT23-6; RoHS Compliant: Yes

## Sheet UTHP Power Supply and PLC.SchDoc: Ultimate Truck Hacking Platform
size Letter; Author: Dr. Jeremy Daily; Organization: Systems Cyber Research Group; Address2: Thomas Balzer; Address3: Carson Green; DocumentNumber: Power, LIN, Logic Buffer; Revision: 1; SheetNumber: 4; SheetTotal: 6
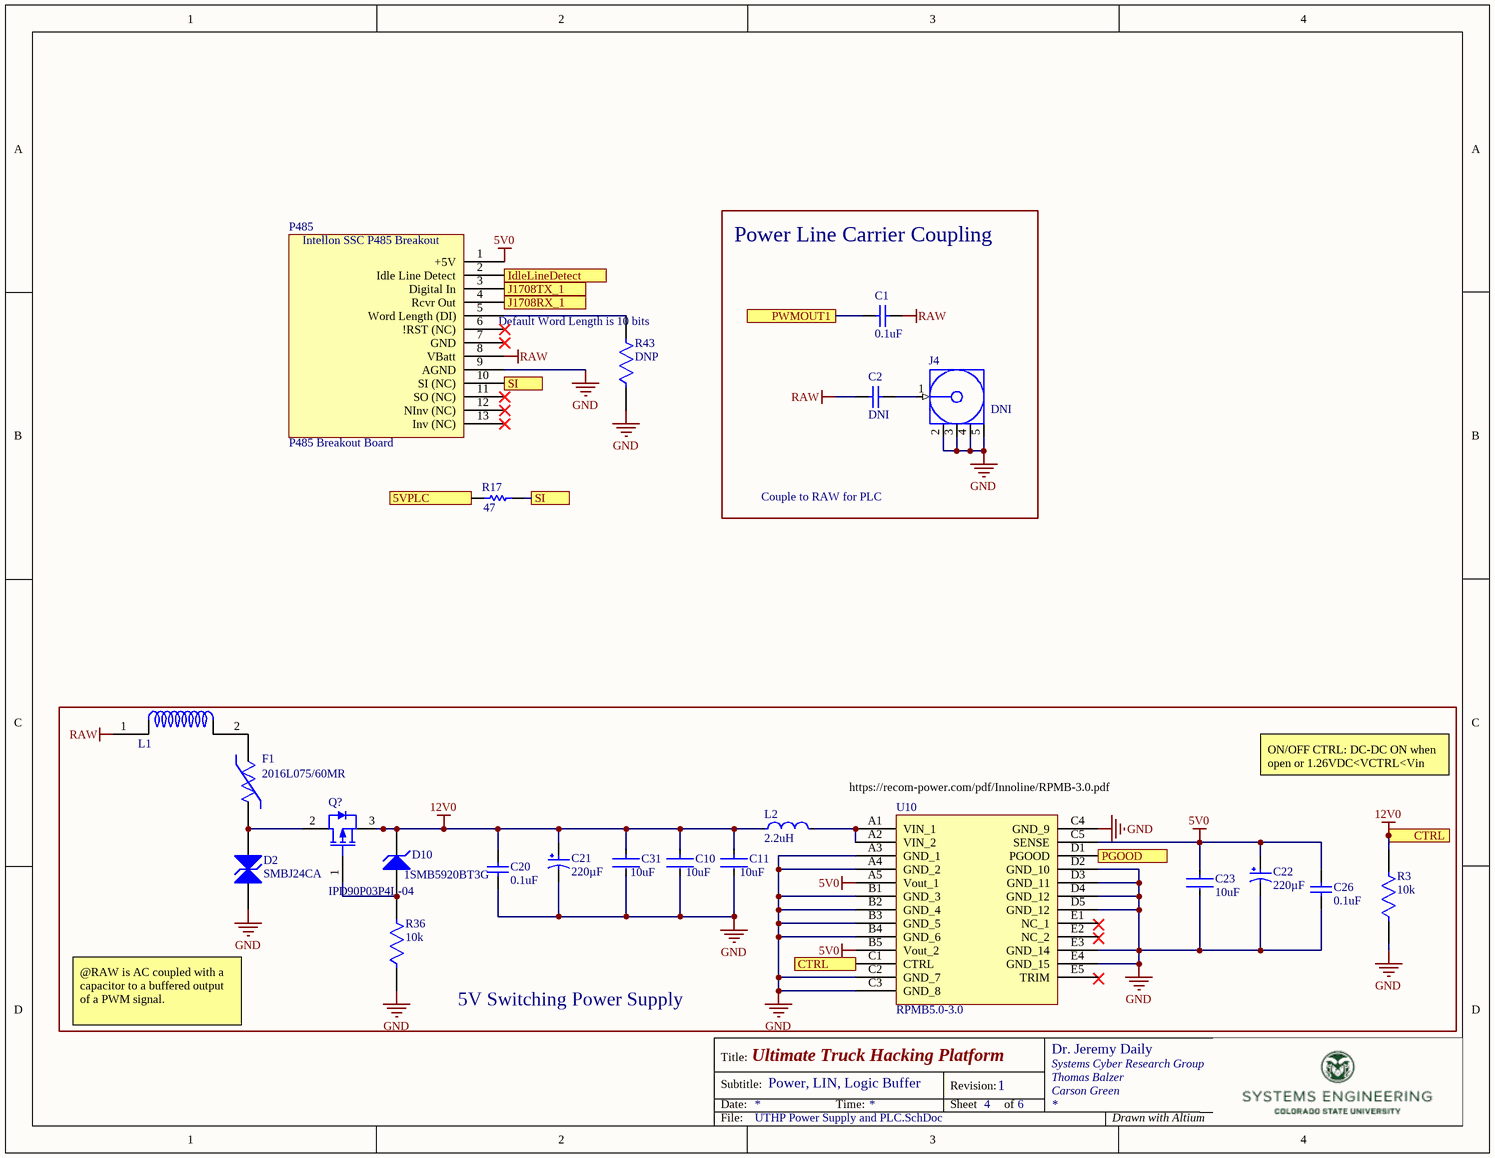
[diagram p3: UTHP Power Supply and PLC.SchDoc]

### Parts
C1  0.1uF  [CAPC1608X90X35LL15T15]
C2  DNI  [CAPC1608X90X35LL15T15]
C10  10uF  [FP-MK325A-MFG]
C11  10uF  [FP-MK325A-MFG]
C20  0.1uF  [CAPC1608X90X35LL15T15]
C21  value 220µF  [CAPPR65-500-1250X1000X1350]  (hidden comment: ECA-1HM221)
C22  value 220µF  [CAPPR65-500-1250X1000X1350]  (hidden comment: ECA-1HM221)
C23  10uF  [FP-MK325A-MFG]
C26  0.1uF  [CAPC1608X90X35LL15T15]
C31  10uF  [FP-MK325A-MFG]
D2  SMBJ24CA  [VISH-DO-214AA-A-2_V]
D10  1SMB5920BT3G  [ONSC-SMB-2-403A-03_H_V]
F1  2016L075/60MR  [FP-2016L075-60MR-MFG]
J4  DNI  [CON-SMA-SMD-RA]
L1  VSAB1770-560M  [VSAB1770-560M-Footprint-1]  (value not drawn)
L2  2.2uH  [FP-LQM2HPN_G0-IPC_C]
P485  P485 Breakout Board  [P485 Breakout Board-Footprint-1]
Q?  IPD90P03P4L-04  [INF-PG-TO252-3-11_M]
R3  10k  [FP-KTR03-IPC_B]
R17  47  [RESC1609X50X30LL10T20]
R36  10k  [FP-KTR03-IPC_B]
R43  DNP  [FP-KTR03-IPC_B]
U10  RPMB5.0-3.0  [New footprint 1]

### Blocks framed on the sheet
Power Line Carrier Coupling: C1 C2 J4
5V Switching Power Supply: C10 C11 C20-C23 C26 C31 D2 D10 F1 L1 L2 Q? R3 R36 U10

### Ports
5VPLC, CTRL, IdleLineDetect, J1708RX_1, J1708TX_1, PGOOD, PWMOUT1, SI

### Nets
5V0: C22.1 C23.1 C26.1 P485.1(+5V) U10.A5(Vout_1) U10.B5(Vout_2) U10.C5(SENSE)
12V0: C10.1 C11.1 C20.1 C21.1 C31.1 D10.1(K) L2.1 Q?.3(SOURCE) R3.2 U10.C1(CTRL) ; port CTRL
GND: C10.2 C11.2 C20.2 C21.2 C22.2 C23.2 C26.2 C31.2 D2.1(A) J4.2(GND) J4.3(GND) J4.4(GND) J4.5(GND) P485.9(AGND) R3.1 R36.1 R43.1 U10.A3(GND_1) U10.A4(GND_2) U10.B1(GND_3) U10.B2(GND_4) U10.B3(GND_5) U10.B4(GND_6) U10.C2(GND_7) U10.C3(GND_8) U10.C4(GND_9) U10.D2(GND_10) U10.D3(GND_11) U10.D4(GND_12) U10.D5(GND_12) U10.E3(GND_14) U10.E4(GND_15)
RAW: C1.1 C2.2 L1.1 P485.8(VBatt)
5VPLC: R17.1 ; port 5VPLC
IdleLineDetect: P485.2(Idle_Line_Detect) ; port IdleLineDetect
J1708RX_1: P485.4(Rcvr_Out) ; port J1708RX_1
J1708TX_1: P485.3(Digital_In) ; port J1708TX_1
PGOOD: U10.D1(PGOOD) ; port PGOOD
PWMOUT1: C1.2 ; port PWMOUT1
SI: P485.10(SI_(NC)) R17.2 ; port SI
NetC2_1: C2.1 J4.1(Signal)
NetD2_2: D2.2(A) F1.2 Q?.2(DRAIN)
NetD10_2: D10.2(A) Q?.1(GATE) R36.2
NetF1_1: F1.1 L1.2
NetL2_2: L2.2 U10.A1(VIN_1) U10.A2(VIN_2)
NetP485_5: P485.5(Word_Length_(DI)) R43.2

Not connected (* = marked no-connect by the designer): P485 6(!RST_(NC))* 7(GND)* 11(SO_(NC))* 12(NInv_(NC))* 13(Inv_(NC))*; U10 E1(NC_1) E2(NC_2) E5(TRIM)

### Notes on the sheet
- (near R43) Default Word Length is 10 bits
- Couple to RAW for PLC
- ON/OFF CTRL: DC-DC ON when open or 1.26VDC<VCTRL<Vin
- https://recom-power.com/pdf/Innoline/RPMB-3.0.pdf
- @RAW is AC coupled with a capacitor to a buffered output of a PWM signal.
- Title:
- Subtitle:
- Date:
- Time:
- Revision:
- Sheet
- of
- File:
- Drawn with Altium
- (in symbol CMP-002-00085-1) Intellon SSC P485 Breakout

### Library data of the parts
C1 C20 C26 = CMP-2006-04387-1: as C4 on sheet UTHP CAN Connections; Supplier 1: Digi-Key; Supplier Part Number 1: 478-KAM15AR71H104KMTR-ND; Value: 0.1uF
C2 = CMP-2006-04387-1: 0.1 µF ±10% 50V Ceramic Capacitor X7R 0603 (1608 Metric); Manufacturer: KYOCERA AVX; Part Number: KAM15AR71H104KM; Value: 0.1uF; Supplier 1: Digi-Key; Supplier Part Number 1: 478-KAM15AR71H104KMTR-ND
C10 C11 C31 = CMP-14477-002214-1: as C16 on sheet UTHP Edge Connectors; Part Number: UMK325AB7106KM-T; Supplier 1: Digi-Key; Supplier Part Number 1: 587-3167-1-ND
C21 C22 = CMP-001-00028-7: 220 µF 50 V Aluminum Electrolytic Capacitors Radial, Can 2000 Hrs @ 85°C; Manufacturer: Panasonic; Part Number: ECA-1HM221; Supplier 1: Digi-Key; Supplier Part Number 1: P5183-ND
C23 = CMP-14477-002214-1: CAP CER 10UF 50V X7R 1210; Termination: SMD/SMT
D2 = CMP-2000-07094-1: 38.9V Clamp 15.4A Ipp Tvs Diode Surface Mount DO-214AA (SMBJ); Manufacturer: Vishay; Part Number: SMBJ24CA-E3/52; Supplier 1: Digi-Key; Supplier Part Number 1: SMBJ24CA-E3/52GICT-ND; Value: TVS Diode
D10 = CMP-1060-00222-1: 3 W Zener Voltage Regulator, 2-Pin SMB, Pb-Free, Tape and Reel; Manufacturer: On Semiconductor
F1 = CMP-08606-000082-1: PTC RESET FUSE 60V 750MA 2016; Manufacturer: LittelFuse Inc; Part Number: 2016L075/60MR; Supplier 1: Digi-Key; Supplier Part Number 1: F6800CT-ND; Value: Reset Fuse
J4 = CMP-0168-00021-1: SMA Female Right Angle Surface Mount Connector
L1 = CMP-006-00023-1: Automotive Molded Power Inductor
L2 = CMP-1662-00028-2: 2.2 µH Shielded Inductor 4 A 73mOhm Max 1210 (3225 Metric) Flat Wire; Manufacturer: Bourns Inc.; Part Number: SRP3212A-2R2M; Value: 2.2 µH; Supplier 1: Digi-Key; Supplier Part Number 1: 118-SRP3212A-2R2MTR-ND
P485 = CMP-002-00085-1: CSU Custom Breaklout for the Itellon SSC P485 breakout board with castlated edges that measures x by y/
Q? = CMP-1138-00142-1: OptiMOS-P2 Power-Transistor, -30 V VDS, -90 A ID, PG-TO252-3-11, Reel, Green; Manufacturer: Infineon; IDpuls (max): -360 A; RthJC (max): 1.1 K/W; VDS (max): -30 V; Ptot (max): 137 W; RDS (on) (max) (@4.5V): 6.8 mOhm; VGS(th) (min): -1 V; QG: 125 nC; Green: TRUE; ID (max): -90 A; VGS(th) (max): -2 V; RDS (on) (max) (@10V): 4.1 mOhm; ComponentLink3URL: http://www.infineon.com/dgdl/BTS142_DS_13.pdf?folderId=db3a3043163797a6011667aa084c0e01&fileId=db3a3043163797a6011667ac98be0e02&location=en.Products.Automotive_ICs.Smart_High-_and_Low-Side_Switches.HITFET___TEMPFET__-_Smart_Low-Side_Switches.DATASHEET.BTS1; ComponentLink3Description: Package Specification; Halogen-free: TRUE; Mounting Technology: Surface Mount; Packing: Reel; DatasheetVersion: Rev. 1.0; ComponentLink2URL: http://www.infineon.com/dgdl/IPD90P03P4L-04_DS_10.pdf?folderId=db3a304314dca3890114ef902baa05f9&fileId=db3a30431ddc9372011e07e8373a27c4&location=en.Products.Automotive_ICs.Automotive_MOSFETs.Single__P-Channel_30V_MOSFETs.DATASHEET.IPD90P03P4L-04_DS_10.pdf; PackageDescription: 3-Pin Plastic (Green) Transistor Single Outline Package, 6.5 x 6.12 mm Body, 2.28 mm Pitch; ComponentLink2Description: Datasheet; PackageVersion: Dec-06; ComponentLink1Description: Manufacturer URL; Technology: OptiMOS-P2; PackageReference: PG-TO252-3-11; PartNumber: IPD90P03P4L-04; ComponentLink1URL: http://www.infineon.com/
R3 R36 = CMP-08839-030382-1: as R1 on sheet UTHP BeagleBone Headers; Supplier 1: Digi-Key; Supplier Part Number 1: RHM10.0KAYCT-ND; Value: 10k
R17 = CMP-2000-03383-1: CRCW060347R0FKEA Res Thick Film 0603 47 Ohm 1% 1/10W ±100ppm/°C Molded SMD Paper T/R; Manufacturer: Vishay Dale; Part Number: CRCW060347R0FKEA; Supplier 1: Digi-Key; Supplier Part Number 1: 541-47.0HCT-ND; Value: 47
R43 = CMP-08839-030382-1: as R25 on sheet UTHP Edge Connectors; Supplier 1: Digi-Key; Supplier Part Number 1: RHM10.0KAYCT-ND
U10 = CMP-001-0001-1: DC-DC Converter, Encapsulated, SMD, 5V@3A, 5.5-36V in, RPMB-3.0 Series

## Sheet UTHP Buffer Circuits.SchDoc: Ultimate Truck Hacking Platform
size Letter; Author: Dr. Jeremy Daily; Organization: Systems Cyber Research Group; Address2: Thomas Balzer; Address3: Carson Green; DocumentNumber: Circuit Protections; Revision: 1; SheetNumber: 5; SheetTotal: 6
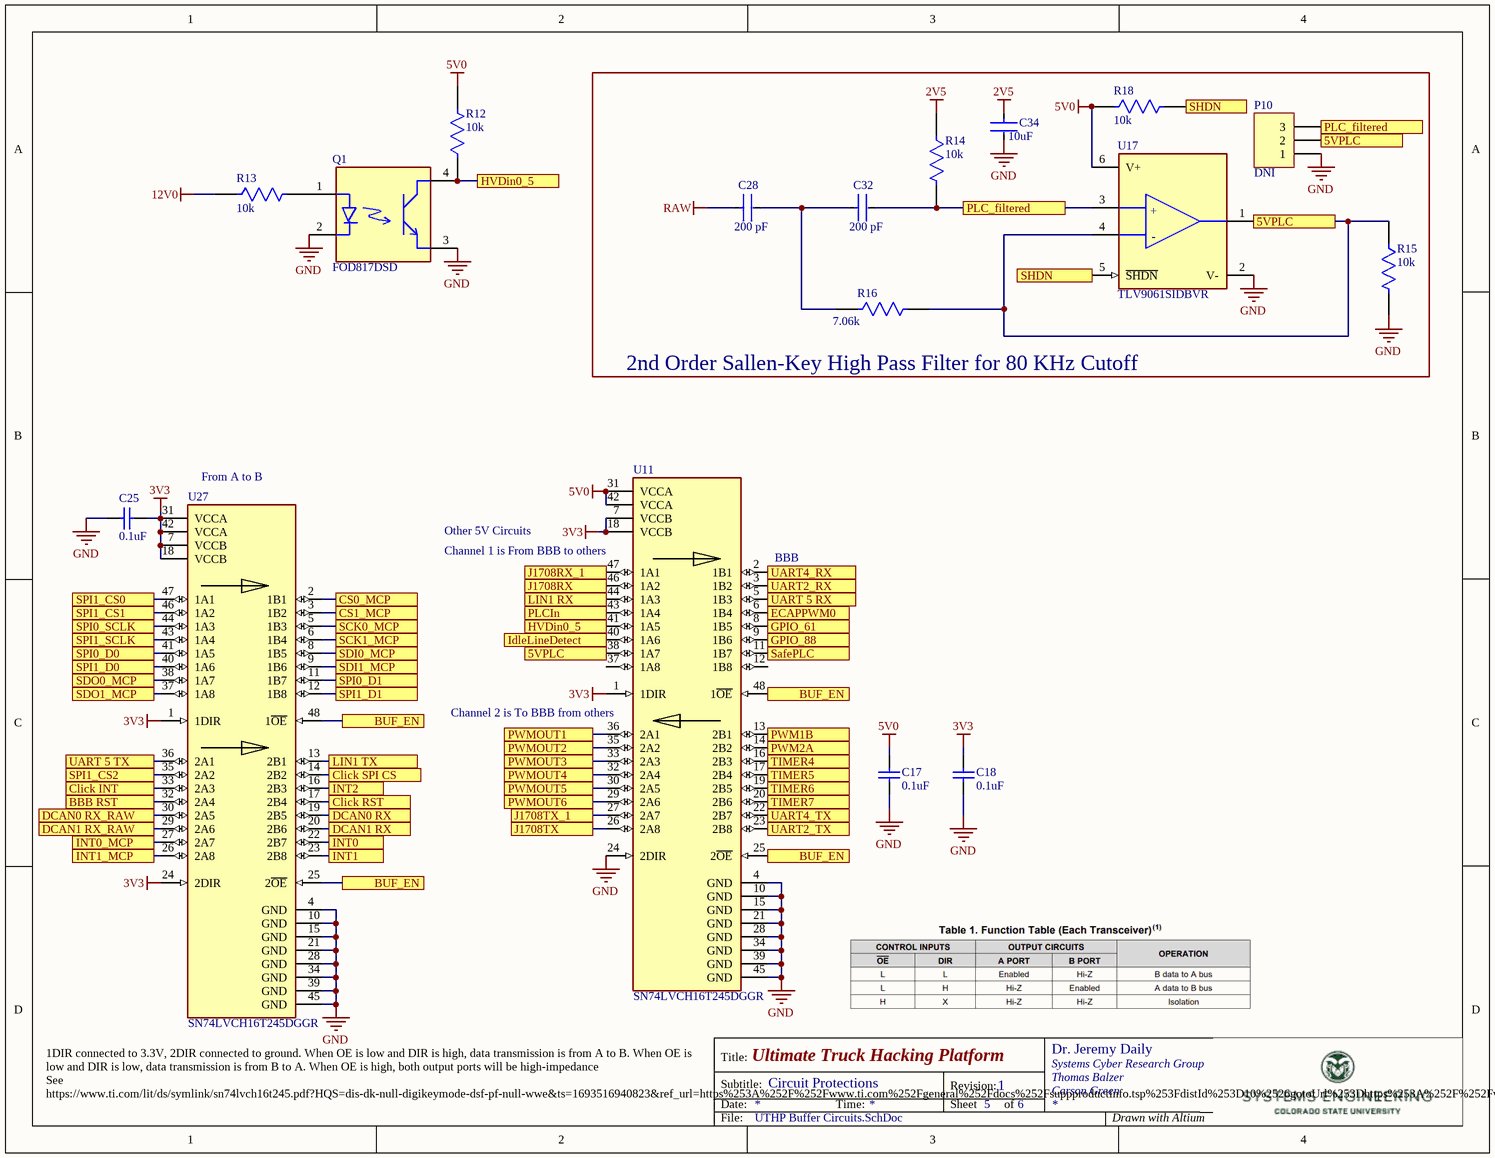
[diagram p4: UTHP Buffer Circuits.SchDoc]

### Parts
C17  0.1uF  [CAPC1608X90X35LL15T15]
C18  0.1uF  [CAPC1608X90X35LL15T15]
C25  0.1uF  [CAPC1608X90X35LL15T15]
C28  value 200 pF  [FP-C0603C-CF-MFG]  (hidden comment: C0603C201J5GACTU)
C32  value 200 pF  [FP-C0603C-CF-MFG]  (hidden comment: C0603C201J5GACTU)
C34  10uF  [FP-MK325A-MFG]
P10  DNI  [HDR1X3]
Q1  FOD817DSD  [FP-709AH-MFG]
R12  10k  [FP-KTR03-IPC_B]
R13  10k  [FP-KTR03-IPC_B]
R14  10k  [FP-KTR03-IPC_B]
R15  10k  [FP-KTR03-IPC_B]
R16  Resistance: 7.06k  [FP-RN731J-IPC_C]  (hidden comment: RN731JTTD7061F25)
R18  10k  [FP-KTR03-IPC_B]
U11  SN74LVCH16T245DGGR  [FP-DGG0048A-MFG]
U17  TLV9061SIDBVR  [FP-DBV0006A-MFG]
U27  SN74LVCH16T245DGGR  [FP-DGG0048A-MFG]

### Blocks framed on the sheet
2nd Order Sallen-Key High Pass Filter for 80 KHz Cutoff: C28 C32 C34 P10 R14-R16 R18 U17

### Ports
5VPLC, BBB RST, BUF_EN, Click INT, Click RST, Click SPI CS, CS0_MCP, CS1_MCP, DCAN0 RX, DCAN0 RX_RAW, DCAN1 RX, DCAN1 RX_RAW, ECAPPWM0, GPIO_61, GPIO_88, HVDin0_5, IdleLineDetect, INT0, INT0_MCP, INT1, INT1_MCP, INT2, J1708RX, J1708RX_1, J1708TX, J1708TX_1, LIN1 RX, LIN1 TX, PLC_filtered, PLCIn, PWM1B, PWM2A, PWMOUT1, PWMOUT2, PWMOUT3, PWMOUT4, PWMOUT5, PWMOUT6, SafePLC, SCK0_MCP, SCK1_MCP, SDI0_MCP, SDI1_MCP, SDO0_MCP, SDO1_MCP, SHDN, SPI0_D0, SPI0_D1, SPI0_SCLK, SPI1_CS0, SPI1_CS1, SPI1_CS2, SPI1_D0, SPI1_D1, SPI1_SCLK, TIMER4, TIMER5, TIMER6, TIMER7, UART2_RX, UART2_TX, UART4_RX, UART4_TX, UART 5 RX, UART 5 TX

### Nets
2V5: C34.1 R14.1
3V3: C18.1 C25.1 U11.1(1DIR) U11.7(VCCB) U11.18(VCCB) U27.1(1DIR) U27.7(VCCB) U27.18(VCCB) U27.24(2DIR) U27.31(VCCA) U27.42(VCCA)
5V0: C17.1 R12.2 R18.1 U11.31(VCCA) U11.42(VCCA) U17.6(V+)
12V0: R13.1
GND: C17.2 C18.2 C25.2 C34.2 P10.1 Q1.2(C) Q1.3(E) R15.2 U11.4(GND) U11.10(GND) U11.15(GND) U11.21(GND) U11.24(2DIR) U11.28(GND) U11.34(GND) U11.39(GND) U11.45(GND) U17.2(V-) U27.4(GND) U27.10(GND) U27.15(GND) U27.21(GND) U27.28(GND) U27.34(GND) U27.39(GND) U27.45(GND)
RAW: C28.1
5VPLC: P10.2 R15.1 R16.2 U11.38(1A7) U17.1(OUT) U17.4(-IN) ; port 5VPLC
BBB RST: U27.32(2A4) ; port BBB RST
BUF_EN: U11.25(2~{OE}) U11.48(1~{OE}) U27.25(2~{OE}) U27.48(1~{OE}) ; port BUF_EN
Click INT: U27.33(2A3) ; port Click INT
Click RST: U27.17(2B4) ; port Click RST
Click SPI CS: U27.14(2B2) ; port Click SPI CS
CS0_MCP: U27.2(1B1) ; port CS0_MCP
CS1_MCP: U27.3(1B2) ; port CS1_MCP
DCAN0 RX: U27.19(2B5) ; port DCAN0 RX
DCAN0 RX_RAW: U27.30(2A5) ; port DCAN0 RX_RAW
DCAN1 RX: U27.20(2B6) ; port DCAN1 RX
DCAN1 RX_RAW: U27.29(2A6) ; port DCAN1 RX_RAW
ECAPPWM0: U11.6(1B4) ; port ECAPPWM0
GPIO_61: U11.8(1B5) ; port GPIO_61
GPIO_88: U11.9(1B6) ; port GPIO_88
HVDin0_5: Q1.4(C) R12.1 U11.41(1A5) ; port HVDin0_5
IdleLineDetect: U11.40(1A6) ; port IdleLineDetect
INT0: U27.22(2B7) ; port INT0
INT0_MCP: U27.27(2A7) ; port INT0_MCP
INT1: U27.23(2B8) ; port INT1
INT1_MCP: U27.26(2A8) ; port INT1_MCP
INT2: U27.16(2B3) ; port INT2
J1708RX: U11.46(1A2) ; port J1708RX
J1708RX_1: U11.47(1A1) ; port J1708RX_1
J1708TX: U11.26(2A8) ; port J1708TX
J1708TX_1: U11.27(2A7) ; port J1708TX_1
LIN1 RX: U11.44(1A3) ; port LIN1 RX
LIN1 TX: U27.13(2B1) ; port LIN1 TX
PLC_filtered: C32.2 P10.3 R14.2 U17.3(+IN) ; port PLC_filtered
PLCIn: U11.43(1A4) ; port PLCIn
PWM1B: U11.13(2B1) ; port PWM1B
PWM2A: U11.14(2B2) ; port PWM2A
PWMOUT1: U11.36(2A1) ; port PWMOUT1
PWMOUT2: U11.35(2A2) ; port PWMOUT2
PWMOUT3: U11.33(2A3) ; port PWMOUT3
PWMOUT4: U11.32(2A4) ; port PWMOUT4
PWMOUT5: U11.30(2A5) ; port PWMOUT5
PWMOUT6: U11.29(2A6) ; port PWMOUT6
SafePLC: U11.11(1B7) ; port SafePLC
SCK0_MCP: U27.5(1B3) ; port SCK0_MCP
SCK1_MCP: U27.6(1B4) ; port SCK1_MCP
SDI0_MCP: U27.8(1B5) ; port SDI0_MCP
SDI1_MCP: U27.9(1B6) ; port SDI1_MCP
SDO0_MCP: U27.38(1A7) ; port SDO0_MCP
SDO1_MCP: U27.37(1A8) ; port SDO1_MCP
SHDN: R18.2 U17.5(~{SHDN}) ; port SHDN
SPI0_D0: U27.41(1A5) ; port SPI0_D0
SPI0_D1: U27.11(1B7) ; port SPI0_D1
SPI0_SCLK: U27.44(1A3) ; port SPI0_SCLK
SPI1_CS0: U27.47(1A1) ; port SPI1_CS0
SPI1_CS1: U27.46(1A2) ; port SPI1_CS1
SPI1_CS2: U27.35(2A2) ; port SPI1_CS2
SPI1_D0: U27.40(1A6) ; port SPI1_D0
SPI1_D1: U27.12(1B8) ; port SPI1_D1
SPI1_SCLK: U27.43(1A4) ; port SPI1_SCLK
TIMER4: U11.16(2B3) ; port TIMER4
TIMER5: U11.17(2B4) ; port TIMER5
TIMER6: U11.19(2B5) ; port TIMER6
TIMER7: U11.20(2B6) ; port TIMER7
UART2_RX: U11.3(1B2) ; port UART2_RX
UART2_TX: U11.23(2B8) ; port UART2_TX
UART4_RX: U11.2(1B1) ; port UART4_RX
UART4_TX: U11.22(2B7) ; port UART4_TX
UART 5 RX: U11.5(1B3) ; port UART 5 RX
UART 5 TX: U27.36(2A1) ; port UART 5 TX
NetC28_2: C28.2 C32.1 R16.1
NetQ1_1: Q1.1(A) R13.2

Not connected (* = marked no-connect by the designer): U11 12(1B8) 37(1A8)

### Notes on the sheet
- (near U27) From A to B
- (near U11) Channel 1 is From BBB to others
- Other 5V Circuits
- (near U11) BBB
- (near U11) Channel 2 is To BBB from others
- (near U27) 1DIR connected to 3.3V, 2DIR connected to ground. When OE is low and DIR is high, data transmission is from A to B. When OE is low and DIR is low, data transmission is from B to A. When OE is high, both output ports will be high-impedance
  See https://www.ti.com/lit/ds/symlink/sn74lvch16t245.pdf?HQS=dis-dk-null-digikeymode-dsf-pf-null-wwe&ts=1693516940823&ref_url=https%253A%252F%252Fwww.ti.com%252Fgeneral%252Fdocs%252Fsuppproductinfo.tsp%253FdistId%253D10%2526gotoUrl%253Dhttps%253A%252F%252Fwww.ti.com%252Flit%252Fgpn%252Fsn74lvch16t245
- Title:
- Subtitle:
- Date:
- Time:
- Revision:
- Sheet
- of
- File:
- Drawn with Altium
- (in symbol CMP-04895-000376-1) +; -

### Library data of the parts
C17 C18 C25 = CMP-2006-04387-1: as C4 on sheet UTHP CAN Connections; Supplier 1: Digi-Key; Supplier Part Number 1: 478-KAM15AR71H104KMTR-ND; Value: 0.1uF
C28 C32 = CMP-1035-01444-3: CAP CER 200PF 50V 5% NP0 0603; Manufacturer: KEMET; Automotive Grade: Grade 1; Temperature Characteristic: C0G; Temperature Coefficient: 30ppm/°C; Tolerance: 0.05; Material: Ceramic; Temperature Range High: +125°C; Digikey Description: CAP CER 200PF 50V 5% NP0 0603; ComponentLink2Description: Datasheet; Package: C0603C-CF; Mouser Description: Multilayer Ceramic Capacitors MLCC - SMD/SMT 50volts 200pF C0G 5%; Voltage Rating: 50 V; Capacitance: 200 pF; Temperature Range Low: -55°C; Device Class L2: Capacitors; Temperature: -55°C to +125°C; Device Class L1: Passive Components; Device Class L3: Ceramic Capacitors; ComponentLink2URL: https://api.kemet.com/component-edge/download/datasheet/C0603C100J5GACAUTO.pdf; Height: 0.87mm; Automotive: Yes; Octopart: https://octopart.com/c0603c201j5gactu-kemet-9143917; Category: Cap; Manufacturer Part Number: C0603C201J5GACTU; Lead Free: Yes; RoHS: TRUE
C34 = CMP-14477-002214-1: as C16 on sheet UTHP Edge Connectors; Part Number: UMK325AB7106KM-T; Supplier 1: Digi-Key; Supplier Part Number 1: 587-3167-1-ND
P10 = CMP-096-000090-1: Header, 3-Pin; Signal Integrity: Connector; LatestRevisionDate: 17-Jul-2002; Publisher: Altium Limited; Design Item ID: Header 3; Source: Miscellaneous Connectors.SchLib; LatestRevisionNote: Re-released for DXP Platform.; Pin Count: 3; Component Type: Standard
Q1 = CMP-2000-06281-2: OPTOISOLATOR 5KV TRANSISTOR 4SMD; Manufacturer: ON Semiconductor; Collector Emitter Voltage: 70V; Forward Voltage: 1.2V; Isolation Voltage: 5000Vrms; Reverse Voltage: 6V; Forward Current: 50mA; Max Junction Temp: +125°C; Power Dissipation: 70mW; Standoff Height: 0.35mm; Min Current Transfer Ratio: 300%; Max Current Transfer Ratio: 600%; Lead Free: Yes; ComponentLink2URL: https://www.onsemi.cn/PowerSolutions/document/FOD814-D.PDF; RoHS: TRUE; Temperature Range Low: -55°C; Height: 3.85mm; Automotive: No; Octopart: https://octopart.com/fod817dsd-on+semiconductor-84327554; Device Class L2: Optocouplers; Emiiter Collector Voltage: 6V; Category: Trans; Device Class L1: Optoelectronics; ComponentLink2Description: Datasheet; Package: 709AH; Temperature Range High: +110°C; Temperature: -55°C to +110°C; Digikey Description: OPTOISOLATOR 5KV TRANSISTOR 4SMD; Device Class L3: unset; Mouser Description: OPTOISOLATOR 5KV TRANSISTOR 4SMD; Manufacturer Part Number: FOD817DSD; Footprint Url: https://www.onsemi.com/pub/Collateral/709AH.PDF
R12-R15 R18 = CMP-08839-030382-1: as R1 on sheet UTHP BeagleBone Headers; Supplier 1: Digi-Key; Supplier Part Number 1: RHM10.0KAYCT-ND; Value: 10k
R16 = CMP-04015-073316-1: 7.06kΩ ±1% 0.063W, 1/16W Chip Resistor 0603 (1608 Metric) Moisture Resistant Thin Film; Temperature Coefficient: 25ppm/°C; Power Rating: 63mW; Voltage Rating: 50V; Min Operating Temperature: -55°C; Case Code (Metric): 1608; Resistor Type: Thin Film; Width: 0.8mm; Weight: 7.1E-05oz; Packaging: Tape and Reel; Case/Package: 0603; Length: 1.6mm; Termination: SMD/SMT; Case Code (Imperial): 0603; Series: RN73; Max Operating Temperature: 125°C; Height: 0.45mm; Tolerance: 1%
U11 U27 = CMP-04899-000008-1: Translation Transceiver 2 Element 8 Bit per Element 3-State Output 48-TSSOP; Manufacturer: Texas Instruments; Value: Bidirectional Translator; Part Number: SN74LVCH16T245DGGR; Supplier 1: Digi-Key; Supplier Part Number 1: 296-19568-1-ND
U17 = CMP-04895-000376-1: IC CMOS 1 CIRCUIT SOT23-6; RoHS Compliant: Yes